# Altium project MacrohardPCB.PrjPcb
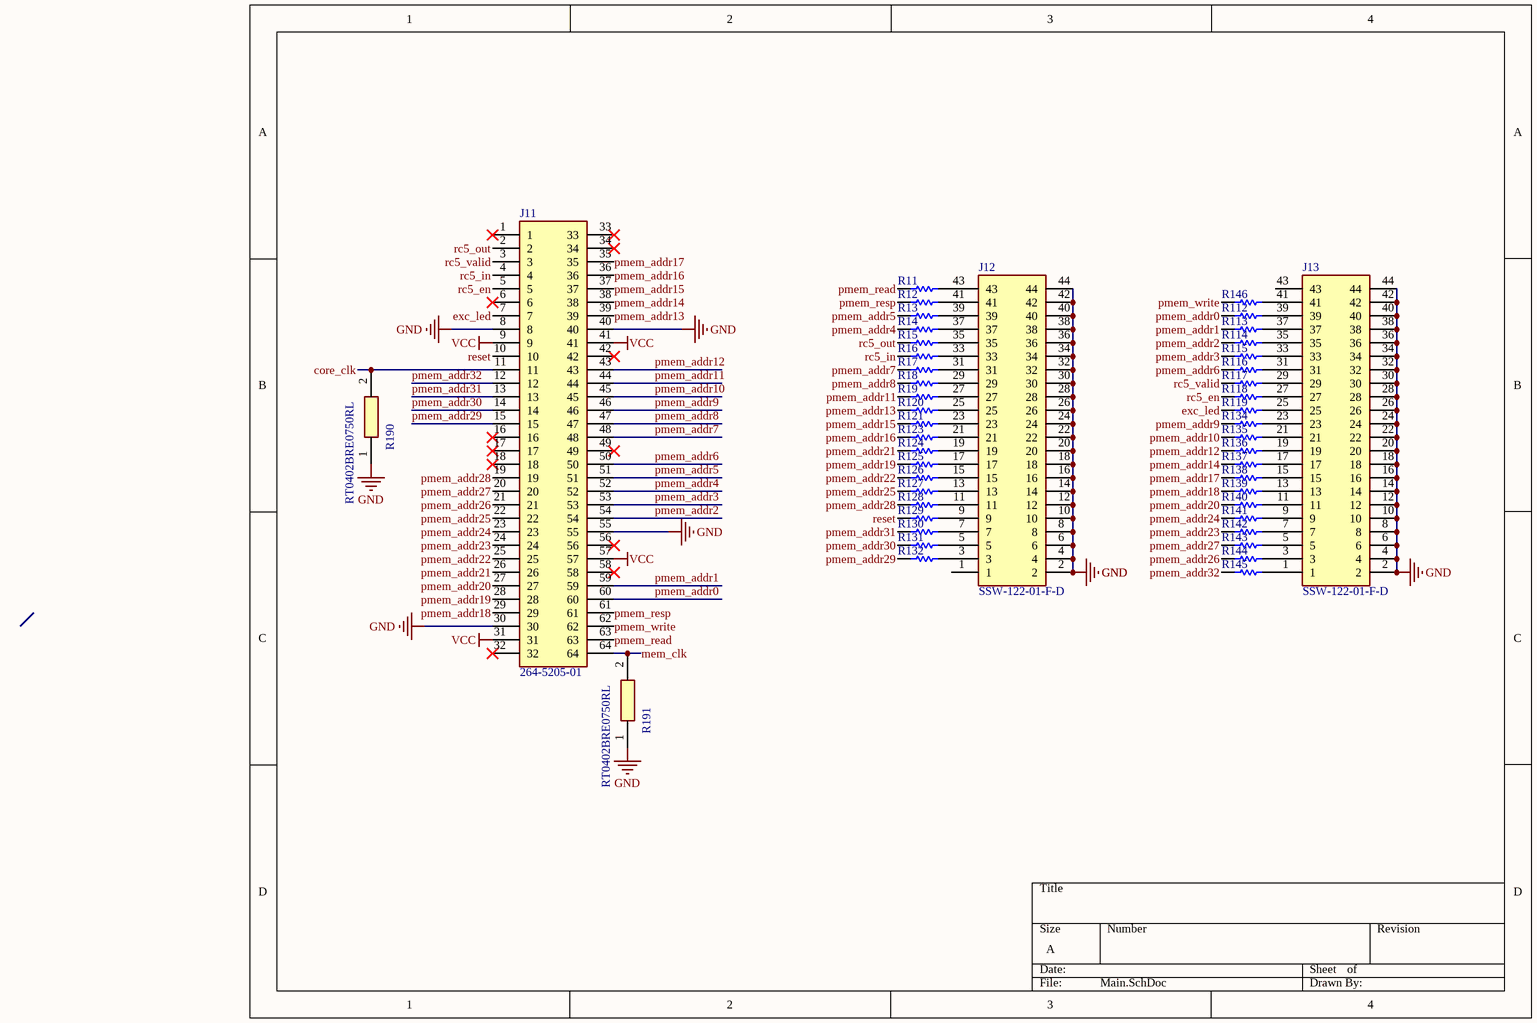
[diagram p0: Main.SchDoc]
2 sheets, 99 parts. Net scope: global (net labels, ports and power ports of the same name join across sheets).
Board file: MacroHardPCB.PcbDoc
Sheets:
  Main.SchDoc
  Connectors.SchDoc

## Sheet Main.SchDoc
size A; SheetNumber: 1; SheetTotal: 2

### Parts
J11  264-5205-01  [264-5205-01_1]
J12  SSW-122-01-F-D  [SSW-122-XX-YYY-D]
J13  SSW-122-01-F-D  [SSW-122-XX-YYY-D]
R11  ERJ-U020R00X  [RESC1005X40X25NL05T10]  (value not drawn)
R12  ERJ-U020R00X  [RESC1005X40X25NL05T10]  (value not drawn)
R13  ERJ-U020R00X  [RESC1005X40X25NL05T10]  (value not drawn)
R14  ERJ-U020R00X  [RESC1005X40X25NL05T10]  (value not drawn)
R15  ERJ-U020R00X  [RESC1005X40X25NL05T10]  (value not drawn)
R16  ERJ-U020R00X  [RESC1005X40X25NL05T10]  (value not drawn)
R17  ERJ-U020R00X  [RESC1005X40X25NL05T10]  (value not drawn)
R18  ERJ-U020R00X  [RESC1005X40X25NL05T10]  (value not drawn)
R19  ERJ-U020R00X  [RESC1005X40X25NL05T10]  (value not drawn)
R112  ERJ-U020R00X  [RESC1005X40X25NL05T10]  (value not drawn)
R113  ERJ-U020R00X  [RESC1005X40X25NL05T10]  (value not drawn)
R114  ERJ-U020R00X  [RESC1005X40X25NL05T10]  (value not drawn)
R115  ERJ-U020R00X  [RESC1005X40X25NL05T10]  (value not drawn)
R116  ERJ-U020R00X  [RESC1005X40X25NL05T10]  (value not drawn)
R117  ERJ-U020R00X  [RESC1005X40X25NL05T10]  (value not drawn)
R118  ERJ-U020R00X  [RESC1005X40X25NL05T10]  (value not drawn)
R119  ERJ-U020R00X  [RESC1005X40X25NL05T10]  (value not drawn)
R120  ERJ-U020R00X  [RESC1005X40X25NL05T10]  (value not drawn)
R121  ERJ-U020R00X  [RESC1005X40X25NL05T10]  (value not drawn)
R123  ERJ-U020R00X  [RESC1005X40X25NL05T10]  (value not drawn)
R124  ERJ-U020R00X  [RESC1005X40X25NL05T10]  (value not drawn)
R125  ERJ-U020R00X  [RESC1005X40X25NL05T10]  (value not drawn)
R126  ERJ-U020R00X  [RESC1005X40X25NL05T10]  (value not drawn)
R127  ERJ-U020R00X  [RESC1005X40X25NL05T10]  (value not drawn)
R128  ERJ-U020R00X  [RESC1005X40X25NL05T10]  (value not drawn)
R129  ERJ-U020R00X  [RESC1005X40X25NL05T10]  (value not drawn)
R130  ERJ-U020R00X  [RESC1005X40X25NL05T10]  (value not drawn)
R131  ERJ-U020R00X  [RESC1005X40X25NL05T10]  (value not drawn)
R132  ERJ-U020R00X  [RESC1005X40X25NL05T10]  (value not drawn)
R134  ERJ-U020R00X  [RESC1005X40X25NL05T10]  (value not drawn)
R135  ERJ-U020R00X  [RESC1005X40X25NL05T10]  (value not drawn)
R136  ERJ-U020R00X  [RESC1005X40X25NL05T10]  (value not drawn)
R137  ERJ-U020R00X  [RESC1005X40X25NL05T10]  (value not drawn)
R138  ERJ-U020R00X  [RESC1005X40X25NL05T10]  (value not drawn)
R139  ERJ-U020R00X  [RESC1005X40X25NL05T10]  (value not drawn)
R140  ERJ-U020R00X  [RESC1005X40X25NL05T10]  (value not drawn)
R141  ERJ-U020R00X  [RESC1005X40X25NL05T10]  (value not drawn)
R142  ERJ-U020R00X  [RESC1005X40X25NL05T10]  (value not drawn)
R143  ERJ-U020R00X  [RESC1005X40X25NL05T10]  (value not drawn)
R144  ERJ-U020R00X  [RESC1005X40X25NL05T10]  (value not drawn)
R145  ERJ-U020R00X  [RESC1005X40X25NL05T10]  (value not drawn)
R146  ERJ-U020R00X  [RESC1005X40X25NL05T10]  (value not drawn)
R190  RT0402BRE0750RL  [RESC1005X35N]
R191  RT0402BRE0750RL  [RESC1005X35N]

### Nets
GND: J11.8 J11.30 J11.40 J11.55 J12.2 J12.4 J12.6 J12.8 J12.10 J12.12 J12.14 J12.16 J12.18 J12.20 J12.22 J12.24 J12.26 J12.28 J12.30 J12.32 J12.34 J12.36 J12.38 J12.40 J12.42 J12.44 J13.2 J13.4 J13.6 J13.8 J13.10 J13.12 J13.14 J13.16 J13.18 J13.20 J13.22 J13.24 J13.26 J13.28 J13.30 J13.32 J13.34 J13.36 J13.38 J13.40 J13.42 J13.44 R190.1 R191.1
VCC: J11.9 J11.31 J11.41 J11.57
core_clk: J11.11 R190.2
exc_led: J11.7 R119.1
mem_clk: J11.64 R191.2
pmem_addr0: J11.60 R112.1
pmem_addr1: J11.59 R113.1
pmem_addr2: J11.54 R114.1
pmem_addr3: J11.53 R115.1
pmem_addr4: J11.52 R14.1
pmem_addr5: J11.51 R13.1
pmem_addr6: J11.50 R116.1
pmem_addr7: J11.48 R17.1
pmem_addr8: J11.47 R18.1
pmem_addr9: J11.46 R134.1
pmem_addr10: J11.45 R135.1
pmem_addr11: J11.44 R19.1
pmem_addr12: J11.43 R136.1
pmem_addr13: J11.39 R120.1
pmem_addr14: J11.38 R137.1
pmem_addr15: J11.37 R121.1
pmem_addr16: J11.36 R123.1
pmem_addr17: J11.35 R138.1
pmem_addr18: J11.29 R139.1
pmem_addr19: J11.28 R125.1
pmem_addr20: J11.27 R140.1
pmem_addr21: J11.26 R124.1
pmem_addr22: J11.25 R126.1
pmem_addr23: J11.24 R142.1
pmem_addr24: J11.23 R141.1
pmem_addr25: J11.22 R127.1
pmem_addr26: J11.21 R144.1
pmem_addr27: J11.20 R143.1
pmem_addr28: J11.19 R128.1
pmem_addr29: J11.15 R132.1
pmem_addr30: J11.14 R131.1
pmem_addr31: J11.13 R130.1
pmem_addr32: J11.12 R145.1
pmem_read: J11.63 R11.1
pmem_resp: J11.61 R12.1
pmem_write: J11.62 R146.1
rc5_en: J11.5 R118.1
rc5_in: J11.4 R16.1
rc5_out: J11.2 R15.1
rc5_valid: J11.3 R117.1
reset: J11.10 R129.1
NetJ12_3: J12.3 R132.2
NetJ12_5: J12.5 R131.2
NetJ12_7: J12.7 R130.2
NetJ12_9: J12.9 R129.2
NetJ12_11: J12.11 R128.2
NetJ12_13: J12.13 R127.2
NetJ12_15: J12.15 R126.2
NetJ12_17: J12.17 R125.2
NetJ12_19: J12.19 R124.2
NetJ12_21: J12.21 R123.2
NetJ12_23: J12.23 R121.2
NetJ12_25: J12.25 R120.2
NetJ12_27: J12.27 R19.2
NetJ12_29: J12.29 R18.2
NetJ12_31: J12.31 R17.2
NetJ12_33: J12.33 R16.2
NetJ12_35: J12.35 R15.2
NetJ12_37: J12.37 R14.2
NetJ12_39: J12.39 R13.2
NetJ12_41: J12.41 R12.2
NetJ12_43: J12.43 R11.2
NetJ13_1: J13.1 R145.2
NetJ13_3: J13.3 R144.2
NetJ13_5: J13.5 R143.2
NetJ13_7: J13.7 R142.2
NetJ13_9: J13.9 R141.2
NetJ13_11: J13.11 R140.2
NetJ13_13: J13.13 R139.2
NetJ13_15: J13.15 R138.2
NetJ13_17: J13.17 R137.2
NetJ13_19: J13.19 R136.2
NetJ13_21: J13.21 R135.2
NetJ13_23: J13.23 R134.2
NetJ13_25: J13.25 R119.2
NetJ13_27: J13.27 R118.2
NetJ13_29: J13.29 R117.2
NetJ13_31: J13.31 R116.2
NetJ13_33: J13.33 R115.2
NetJ13_35: J13.35 R114.2
NetJ13_37: J13.37 R113.2
NetJ13_39: J13.39 R112.2
NetJ13_41: J13.41 R146.2

Not connected (* = marked no-connect by the designer): J11 1* 6* 16* 17* 18* 32* 33* 34* 42* 49* 56* 58*; J12 1; J13 43

### Library data of the parts
J11 = 264-5205-01: Connector; Manufacturer_Name: 3M; Datasheet Link: http://multimedia.3m.com/mws/media/785854O/3mtm-textooltm-open-top-sockets-for-qfn-applications-cd2475.pdf; Manufacturer_Part_Number: 264-5205-01; Mouser Part Number: 517-264-5205-01; Mouser Price/Stock: https://www.mouser.co.uk/ProductDetail/3M-Electronic-Solutions-Division/264-5205-01?qs=B2toaPEvOxGh%252BVXp%252BJO7wQ%3D%3D
J12 J13 = SSW-122-01-F-D: Connector; Manufacturer_Name: SAMTEC; Datasheet Link: http://suddendocs.samtec.com/prints/ssw-1xx-xx-xxx-x-xx-xxx-xx-mkt.pdf; Manufacturer_Part_Number: SSW-122-01-F-D; Mouser Part Number: 200-SSW12201FD; Mouser Price/Stock: https://www.mouser.co.uk/ProductDetail/Samtec/SSW-122-01-F-D?qs=92ilVni64gyO3fMj7LXwKw%3D%3D; Arrow Part Number: SSW-122-01-F-D; Arrow Price/Stock: https://www.arrow.com/en/products/ssw-122-01-f-d/samtec
R11-R19 R112-R121 R123-R132 R134-R146 = CMP-2002-06457-1: Manufacturer: Panasonic; Part Number: ERJ-U020R00X
R190 R191 = RT0402BRE0750RL: Resistor; Manufacturer_Name: YAGEO; Datasheet Link: https://www.mouser.com/datasheet/2/447/PYu_RT_1_to_0_01_RoHS_L_12-3003070.pdf; Height: 0.35mm; Manufacturer_Part_Number: RT0402BRE0750RL; Mouser Part Number: 603-RT0402BRE0750RL; Mouser Price/Stock: https://www.mouser.co.uk/ProductDetail/YAGEO/RT0402BRE0750RL?qs=NgbZBzc1CyFyREnSBGZFUg%3D%3D; Arrow Part Number: RT0402BRE0750RL; Arrow Price/Stock: https://www.arrow.com/en/products/rt0402bre0750rl/yageo?region=nac

## Sheet Connectors.SchDoc
size A; SheetNumber: 2; SheetTotal: 2
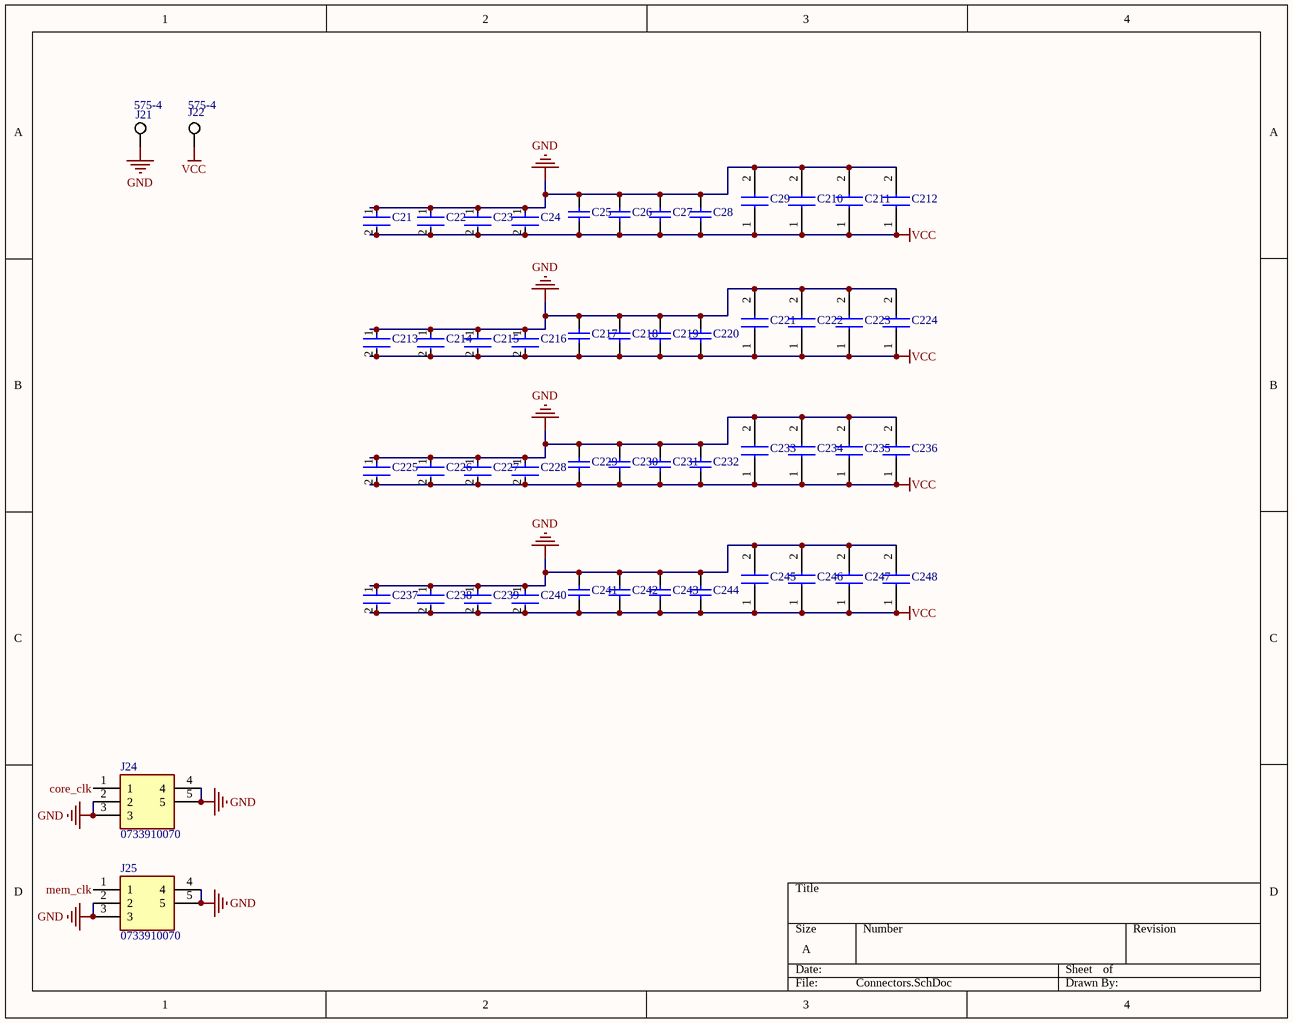
[diagram p1: Connectors.SchDoc]

### Parts
C21  UMK105BJ104KV-F  [FP-0402-L_1_0_0_05-W_0_5-IPC_B]  (value not drawn)
C22  UMK105BJ104KV-F  [FP-0402-L_1_0_0_05-W_0_5-IPC_B]  (value not drawn)
C23  UMK105BJ104KV-F  [FP-0402-L_1_0_0_05-W_0_5-IPC_B]  (value not drawn)
C24  UMK105BJ104KV-F  [FP-0402-L_1_0_0_05-W_0_5-IPC_B]  (value not drawn)
C25  LMK107B7105KA-T  [CAPC1608X90X35NL10T25]  (value not drawn)
C26  LMK107B7105KA-T  [CAPC1608X90X35NL10T25]  (value not drawn)
C27  LMK107B7105KA-T  [CAPC1608X90X35NL10T25]  (value not drawn)
C28  LMK107B7105KA-T  [CAPC1608X90X35NL10T25]  (value not drawn)
C29  KGM15CR51A106MT  [CAPC1608X100N]  (value not drawn)
C210  KGM15CR51A106MT  [CAPC1608X100N]  (value not drawn)
C211  KGM15CR51A106MT  [CAPC1608X100N]  (value not drawn)
C212  KGM15CR51A106MT  [CAPC1608X100N]  (value not drawn)
C213  UMK105BJ104KV-F  [FP-0402-L_1_0_0_05-W_0_5-IPC_B]  (value not drawn)
C214  UMK105BJ104KV-F  [FP-0402-L_1_0_0_05-W_0_5-IPC_B]  (value not drawn)
C215  UMK105BJ104KV-F  [FP-0402-L_1_0_0_05-W_0_5-IPC_B]  (value not drawn)
C216  UMK105BJ104KV-F  [FP-0402-L_1_0_0_05-W_0_5-IPC_B]  (value not drawn)
C217  LMK107B7105KA-T  [CAPC1608X90X35NL10T25]  (value not drawn)
C218  LMK107B7105KA-T  [CAPC1608X90X35NL10T25]  (value not drawn)
C219  LMK107B7105KA-T  [CAPC1608X90X35NL10T25]  (value not drawn)
C220  LMK107B7105KA-T  [CAPC1608X90X35NL10T25]  (value not drawn)
C221  KGM15CR51A106MT  [CAPC1608X100N]  (value not drawn)
C222  KGM15CR51A106MT  [CAPC1608X100N]  (value not drawn)
C223  KGM15CR51A106MT  [CAPC1608X100N]  (value not drawn)
C224  KGM15CR51A106MT  [CAPC1608X100N]  (value not drawn)
C225  UMK105BJ104KV-F  [FP-0402-L_1_0_0_05-W_0_5-IPC_B]  (value not drawn)
C226  UMK105BJ104KV-F  [FP-0402-L_1_0_0_05-W_0_5-IPC_B]  (value not drawn)
C227  UMK105BJ104KV-F  [FP-0402-L_1_0_0_05-W_0_5-IPC_B]  (value not drawn)
C228  UMK105BJ104KV-F  [FP-0402-L_1_0_0_05-W_0_5-IPC_B]  (value not drawn)
C229  LMK107B7105KA-T  [CAPC1608X90X35NL10T25]  (value not drawn)
C230  LMK107B7105KA-T  [CAPC1608X90X35NL10T25]  (value not drawn)
C231  LMK107B7105KA-T  [CAPC1608X90X35NL10T25]  (value not drawn)
C232  LMK107B7105KA-T  [CAPC1608X90X35NL10T25]  (value not drawn)
C233  KGM15CR51A106MT  [CAPC1608X100N]  (value not drawn)
C234  KGM15CR51A106MT  [CAPC1608X100N]  (value not drawn)
C235  KGM15CR51A106MT  [CAPC1608X100N]  (value not drawn)
C236  KGM15CR51A106MT  [CAPC1608X100N]  (value not drawn)
C237  UMK105BJ104KV-F  [FP-0402-L_1_0_0_05-W_0_5-IPC_B]  (value not drawn)
C238  UMK105BJ104KV-F  [FP-0402-L_1_0_0_05-W_0_5-IPC_B]  (value not drawn)
C239  UMK105BJ104KV-F  [FP-0402-L_1_0_0_05-W_0_5-IPC_B]  (value not drawn)
C240  UMK105BJ104KV-F  [FP-0402-L_1_0_0_05-W_0_5-IPC_B]  (value not drawn)
C241  LMK107B7105KA-T  [CAPC1608X90X35NL10T25]  (value not drawn)
C242  LMK107B7105KA-T  [CAPC1608X90X35NL10T25]  (value not drawn)
C243  LMK107B7105KA-T  [CAPC1608X90X35NL10T25]  (value not drawn)
C244  LMK107B7105KA-T  [CAPC1608X90X35NL10T25]  (value not drawn)
C245  KGM15CR51A106MT  [CAPC1608X100N]  (value not drawn)
C246  KGM15CR51A106MT  [CAPC1608X100N]  (value not drawn)
C247  KGM15CR51A106MT  [CAPC1608X100N]  (value not drawn)
C248  KGM15CR51A106MT  [CAPC1608X100N]  (value not drawn)
J21  575-4  [KSTN-575-4]
J22  575-4  [KSTN-575-4]
J24  0733910070  [0733910070]
J25  0733910070  [0733910070]

### Nets
GND: C21.1 C22.1 C23.1 C24.1 C25.2 C26.2 C27.2 C28.2 C29.2 C210.2 C211.2 C212.2 C213.1 C214.1 C215.1 C216.1 C217.2 C218.2 C219.2 C220.2 C221.2 C222.2 C223.2 C224.2 C225.1 C226.1 C227.1 C228.1 C229.2 C230.2 C231.2 C232.2 C233.2 C234.2 C235.2 C236.2 C237.1 C238.1 C239.1 C240.1 C241.2 C242.2 C243.2 C244.2 C245.2 C246.2 C247.2 C248.2 J21.1 J24.2 J24.3 J24.4 J24.5 J25.2 J25.3 J25.4 J25.5
VCC: C21.2 C22.2 C23.2 C24.2 C25.1 C26.1 C27.1 C28.1 C29.1 C210.1 C211.1 C212.1 C213.2 C214.2 C215.2 C216.2 C217.1 C218.1 C219.1 C220.1 C221.1 C222.1 C223.1 C224.1 C225.2 C226.2 C227.2 C228.2 C229.1 C230.1 C231.1 C232.1 C233.1 C234.1 C235.1 C236.1 C237.2 C238.2 C239.2 C240.2 C241.1 C242.1 C243.1 C244.1 C245.1 C246.1 C247.1 C248.1 J22.1
core_clk: J24.1
mem_clk: J25.1

### Library data of the parts
C21-C24 C213-C216 C225-C228 C237-C240 = CMP-14477-000330-2: None; Voltage Rating (DC): 50V; Capacitance: 100nF; Dielectric: X5R; Tolerance: 10%; RoHS Compliant: Yes; Termination: SMD/SMT; Packaging: Tape and Reel; Height: 0.5mm; Halogen Free: Halogen Free; Case Code (Metric): 1005; Width: 0.02inch; Max Operating Temperature: 85°C; Voltage Rating: 50V; Min Operating Temperature: -55°C; Package Quantity: 10000; Case/Package: 0402; Case Code (Imperial): 0402; Length: 0.039inch; Thickness: 0.022inch; Mount: Surface Mount
C25-C28 C217-C220 C229-C232 C241-C244 = CMP-2000-05445-2: None; Dielectric: X7R; Tolerance: 10%; Voltage Rating: 10V; Capacitance: 1uF; Halogen Free: Halogen Free; Construction: Flat; Max Operating Temperature: 125°C; Packaging: Tape and Reel; REACH SVHC: No SVHC; Width: 0.031inch; Case/Package: 0603; Number of Pins: 2; Resistor Type: Ceramic; Case Code (Imperial): 0603; Termination: SMD/SMT; RoHS Compliant: Yes; Depth: 0.8mm; Height: 0.8mm; Mount: Surface Mount; Case Code (Metric): 1608; Voltage Rating (DC): 10V; Series: M; Length: 1.6mm; Radiation Hardening: No; Lead Free: Lead Free; Min Operating Temperature: -55°C; Thickness: 0.035inch; Package Quantity: 1
C29 C210-C212 C221-C224 C233-C236 C245-C248 = KGM15CR51A106MT: Capacitor; Manufacturer_Name: AVX; Datasheet Link: https://4donline.ihs.com/images/VipMasterIC/IC/AVXC/AVXC-S-A0018162488/AVXC-S-A0018400965-1.pdf?hkey=EF798316E3902B6ED9A73243A3159BB0; Height: 1mm; Manufacturer_Part_Number: KGM15CR51A106MT
J21 J22 = CMP-2000-05649-1: Banana Jack, Non-Insulated, 1-Pin THD, RoHS, Bulk; Manufacturer: Keystone-Electronics; Package Version: Rev. B, 11/1994; Plug/Mating Plug Diameter: StandardBanana; Gender: Female; Package Reference: 575-4; Operating Temperature: -; Contact Material: Brass; Packaging: Bulk; Series: -; Category: Connectors,Interconnects; Color: -; Type: BananaJack; Contact Finish: Nickel; Features: -; Family: BananaandTipConnectors-Jacks,Plugs; Body Material: -; Manufacturer URL: http://www.keyelco.com/; Termination: Solder; Insulation: Non-Insulated; Datasheet Version: Rev. B, 11/1994; Mounting Technology: ThroughHole; Package URL: http://www.keyelco.com/product-pdf.cfm?p=2379; Mounting Type: ThroughHole; Package Description: 1-Pin Through Hole Device, Dia 7.92 mm; Datasheet URL: http://www.keyelco.com/product-pdf.cfm?p=2379; Wire Gauge: -
J24 J25 = 0733910070: Connector; Manufacturer_Name: Molex; Datasheet Link: https://www.molex.com/pdm_docs/sd/733910070_sd.pdf; Height: 10mm; Manufacturer_Part_Number: 0733910070; Mouser Part Number: N/A; Mouser Price/Stock: https://www.mouser.co.uk/ProductDetail/Molex/0733910070?qs=PBcRNPEHKsq1tOlFMTxPGQ%3D%3D; Arrow Part Number: 0733910070; Arrow Price/Stock: https://www.arrow.com/en/products/0733910070/molex

## Nets that join several sheets
GND: Main (50 pins), Connectors (57 pins)
VCC: Main (J11.9 J11.31 J11.41 J11.57), Connectors (49 pins)
core_clk: Main (J11.11 R190.2), Connectors (J24.1)
mem_clk: Main (J11.64 R191.2), Connectors (J25.1)